# Altium schematic sheet ALU (4).SchDoc: Комбинационный сумматор
size 420 x 297 mm; CheckedBy: Хисамов; Author: Радионова; SheetNumber: 1; SheetTotal: 2; DocumentType: Схема электрическая принципиальная; DocumentName: Sheet1.SCHDOC
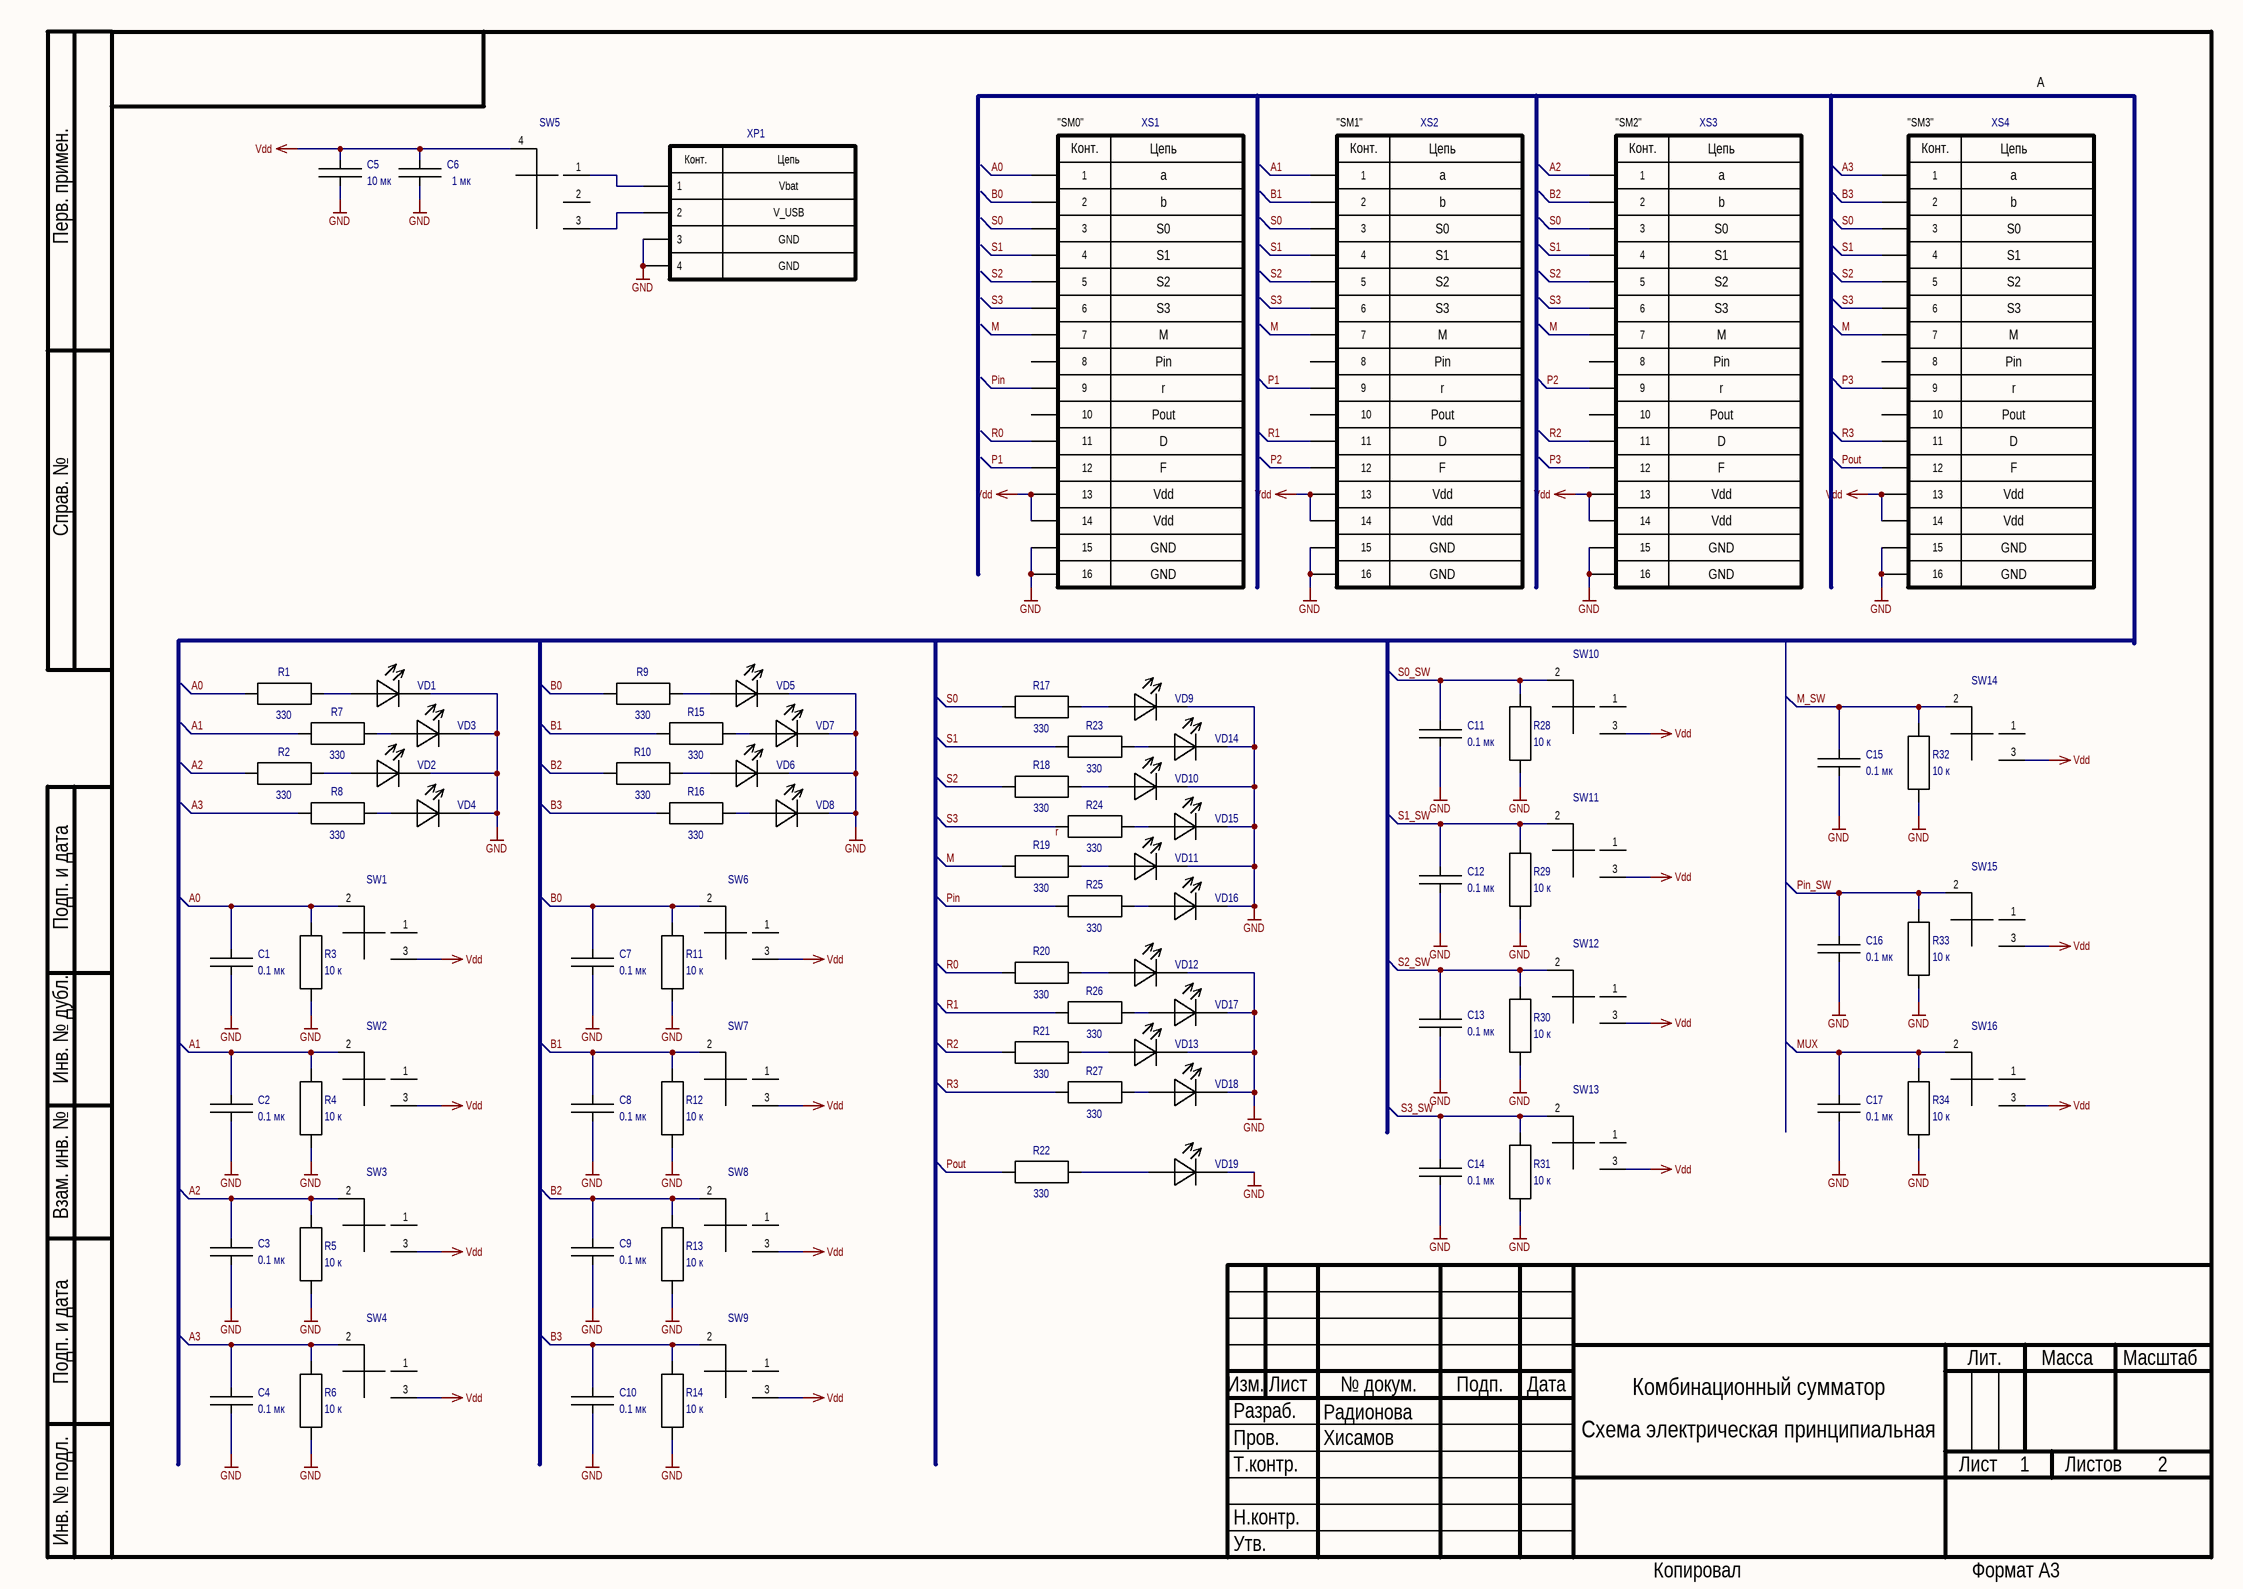
[diagram p0: ALU (4).SchDoc]

## Parts
C1  value 0.1 мк  [C0603]  (hidden comment: 0.1 мкФ ±* * * *, *)
C2  value 0.1 мк  [C0603]  (hidden comment: 0.1 мкФ ±* * * *, *)
C3  value 0.1 мк  [C0603]  (hidden comment: 0.1 мкФ ±* * * *, *)
C4  value 0.1 мк  [C0603]  (hidden comment: 0.1 мкФ ±* * * *, *)
C5  value 10 мк  [C0603]  (hidden comment: 10 мкФ ±* * * *, *)
C6  value 1 мк  [C0603]  (hidden comment: 1 мкФ ±* * * *, *)
C7  value 0.1 мк  [C0603]  (hidden comment: 0.1 мкФ ±* * * *, *)
C8  value 0.1 мк  [C0603]  (hidden comment: 0.1 мкФ ±* * * *, *)
C9  value 0.1 мк  [C0603]  (hidden comment: 0.1 мкФ ±* * * *, *)
C10  value 0.1 мк  [C0603]  (hidden comment: 0.1 мкФ ±* * * *, *)
C11  value 0.1 мк  [C0603]  (hidden comment: 0.1 мкФ ±* * * *, *)
C12  value 0.1 мк  [C0603]  (hidden comment: 0.1 мкФ ±* * * *, *)
C13  value 0.1 мк  [C0603]  (hidden comment: 0.1 мкФ ±* * * *, *)
C14  value 0.1 мк  [C0603]  (hidden comment: 0.1 мкФ ±* * * *, *)
C15  value 0.1 мк  [C0603]  (hidden comment: 0.1 мкФ ±* * * *, *)
C16  value 0.1 мк  [C0603]  (hidden comment: 0.1 мкФ ±* * * *, *)
C17  value 0.1 мк  [C0603]  (hidden comment: 0.1 мкФ ±* * * *, *)
R1  value 330  [P1-12-0.1(0603)]
R2  value 330  [P1-12-0.1(0603)]
R3  value 10 к  [P1-12-0.1(0603)]
R4  value 10 к  [P1-12-0.1(0603)]
R5  value 10 к  [P1-12-0.1(0603)]
R6  value 10 к  [P1-12-0.1(0603)]
R7  value 330  [P1-12-0.1(0603)]
R8  value 330  [P1-12-0.1(0603)]
R9  value 330  [P1-12-0.1(0603)]
R10  value 330  [P1-12-0.1(0603)]
R11  value 10 к  [P1-12-0.1(0603)]
R12  value 10 к  [P1-12-0.1(0603)]
R13  value 10 к  [P1-12-0.1(0603)]
R14  value 10 к  [P1-12-0.1(0603)]
R15  value 330  [P1-12-0.1(0603)]
R16  value 330  [P1-12-0.1(0603)]
R17  value 330  [P1-12-0.1(0603)]
R18  value 330  [P1-12-0.1(0603)]
R19  value 330  [P1-12-0.1(0603)]
R20  value 330  [P1-12-0.1(0603)]
R21  value 330  [P1-12-0.1(0603)]
R22  value 330  [P1-12-0.1(0603)]
R23  value 330  [P1-12-0.1(0603)]
R24  value 330  [P1-12-0.1(0603)]
R25  value 330  [P1-12-0.1(0603)]
R26  value 330  [P1-12-0.1(0603)]
R27  value 330  [P1-12-0.1(0603)]
R28  value 10 к  [P1-12-0.1(0603)]
R29  value 10 к  [P1-12-0.1(0603)]
R30  value 10 к  [P1-12-0.1(0603)]
R31  value 10 к  [P1-12-0.1(0603)]
R32  value 10 к  [P1-12-0.1(0603)]
R33  value 10 к  [P1-12-0.1(0603)]
R34  value 10 к  [P1-12-0.1(0603)]
SW1  SW_two  [MSS-22D18 MSS22D18G2]  (value not drawn)
SW2  SW_two  [MSS-22D18 MSS22D18G2]  (value not drawn)
SW3  SW_two  [MSS-22D18 MSS22D18G2]  (value not drawn)
SW4  SW_two  [MSS-22D18 MSS22D18G2]  (value not drawn)
SW5  *  [sw-3]  (value not drawn)
SW6  SW_two  [MSS-22D18 MSS22D18G2]  (value not drawn)
SW7  SW_two  [MSS-22D18 MSS22D18G2]  (value not drawn)
SW8  SW_two  [MSS-22D18 MSS22D18G2]  (value not drawn)
SW9  SW_two  [MSS-22D18 MSS22D18G2]  (value not drawn)
SW10  SW_two  [MSS-22D18 MSS22D18G2]  (value not drawn)
SW11  SW_two  [MSS-22D18 MSS22D18G2]  (value not drawn)
SW12  SW_two  [MSS-22D18 MSS22D18G2]  (value not drawn)
SW13  SW_two  [MSS-22D18 MSS22D18G2]  (value not drawn)
SW14  SW_two  [MSS-22D18 MSS22D18G2]  (value not drawn)
SW15  SW_two  [MSS-22D18 MSS22D18G2]  (value not drawn)
SW16  SW_two  [MSS-22D18 MSS22D18G2]  (value not drawn)
VD1  VD - Светодиод  [LED 0603]  (value not drawn)
VD2  VD - Светодиод  [LED 0603]  (value not drawn)
VD3  VD - Светодиод  [LED 0603]  (value not drawn)
VD4  VD - Светодиод  [LED 0603]  (value not drawn)
VD5  VD - Светодиод  [LED 0603]  (value not drawn)
VD6  VD - Светодиод  [LED 0603]  (value not drawn)
VD7  VD - Светодиод  [LED 0603]  (value not drawn)
VD8  VD - Светодиод  [LED 0603]  (value not drawn)
VD9  VD - Светодиод  [LED 0603]  (value not drawn)
VD10  VD - Светодиод  [LED 0603]  (value not drawn)
VD11  VD - Светодиод  [LED 0603]  (value not drawn)
VD12  VD - Светодиод  [LED 0603]  (value not drawn)
VD13  VD - Светодиод  [LED 0603]  (value not drawn)
VD14  VD - Светодиод  [LED 0603]  (value not drawn)
VD15  VD - Светодиод  [LED 0603]  (value not drawn)
VD16  VD - Светодиод  [LED 0603]  (value not drawn)
VD17  VD - Светодиод  [LED 0603]  (value not drawn)
VD18  VD - Светодиод  [LED 0603]  (value not drawn)
VD19  VD - Светодиод  [LED 0603]  (value not drawn)
XP1  1: Vbat  2: V_USB  3: GND  (hidden comment: XP - Вилка - х4)
XS1  XS - Розетка - PBD-16  [PLD-16Norm]  (value not drawn)  (net tie, no BOM)
XS2  XS - Розетка - PBD-16  [PLD-16Norm]  (value not drawn)  (net tie, no BOM)
XS3  XS - Розетка - PBD-16  [PLD-16Norm]  (value not drawn)  (net tie, no BOM)
XS4  XS - Розетка - PBD-16  [PLD-16Norm]  (value not drawn)  (net tie, no BOM)

## Nets
GND: C1.1 C2.1 C3.1 C4.1 C5.1 C6.1 C7.1 C8.1 C9.1 C10.1 C11.1 C12.1 C13.1 C14.1 C15.1 C16.1 C17.1 R3.2 R4.2 R5.2 R6.2 R11.2 R12.2 R13.2 R14.2 R28.2 R29.2 R30.2 R31.2 R32.2 R33.2 R34.2 VD1.2(C) VD2.2(C) VD3.2(C) VD4.2(C) VD5.2(C) VD6.2(C) VD7.2(C) VD8.2(C) VD9.2(C) VD10.2(C) VD11.2(C) VD12.2(C) VD13.2(C) VD14.2(C) VD15.2(C) VD16.2(C) VD17.2(C) VD18.2(C) VD19.2(C) XP1.3 XP1.4 XS1.15 XS1.16 XS2.15 XS2.16 XS3.15 XS3.16 XS4.15 XS4.16
Vdd: C5.2 C6.2 SW1.3 SW2.3 SW3.3 SW4.3 SW5.4 SW6.3 SW7.3 SW8.3 SW9.3 SW10.3 SW11.3 SW12.3 SW13.3 SW14.3 SW15.3 SW16.3 XS1.13 XS1.14 XS2.13 XS2.14 XS3.13 XS3.14 XS4.13 XS4.14
A0: C1.2 R1.1 R3.1 SW1.2 XS1.1
A1: C2.2 R4.1 R7.1 SW2.2 XS2.1
A2: C3.2 R2.1 R5.1 SW3.2 XS3.1
A3: C4.2 R6.1 R8.1 SW4.2 XS4.1
B0: C7.2 R9.1 R11.1 SW6.2 XS1.2
B1: C8.2 R12.1 R15.1 SW7.2 XS2.2
B2: C9.2 R10.1 R13.1 SW8.2 XS3.2
B3: C10.2 R14.1 R16.1 SW9.2 XS4.2
M: R19.1 XS1.7 XS2.7 XS3.7 XS4.7
M_SW: C15.2 R32.1 SW14.2
MUX: C17.2 R34.1 SW16.2
P1: XS1.12 XS2.9
P2: XS2.12 XS3.9
P3: XS3.12 XS4.9
Pin: R25.1 XS1.9
Pin_SW: C16.2 R33.1 SW15.2
Pout: R22.1 XS4.12
R0: R20.1 XS1.11
R1: R26.1 XS2.11
R2: R21.1 XS3.11
R3: R27.1 XS4.11
S0: R17.1 XS1.3 XS2.3 XS3.3 XS4.3
S0_SW: C11.2 R28.1 SW10.2
S1: R23.1 XS1.4 XS2.4 XS3.4 XS4.4
S1_SW: C12.2 R29.1 SW11.2
S2: R18.1 XS1.5 XS2.5 XS3.5 XS4.5
S2_SW: C13.2 R30.1 SW12.2
S3: R24.1 XS1.6 XS2.6 XS3.6 XS4.6
S3_SW: C14.2 R31.1 SW13.2
NetR1_2: R1.2 VD1.1(A)
NetR2_2: R2.2 VD2.1(A)
NetR7_2: R7.2 VD3.1(A)
NetR8_2: R8.2 VD4.1(A)
NetR9_2: R9.2 VD5.1(A)
NetR10_2: R10.2 VD6.1(A)
NetR15_2: R15.2 VD7.1(A)
NetR16_2: R16.2 VD8.1(A)
NetR17_2: R17.2 VD9.1(A)
NetR18_2: R18.2 VD10.1(A)
NetR19_2: R19.2 VD11.1(A)
NetR20_2: R20.2 VD12.1(A)
NetR21_2: R21.2 VD13.1(A)
NetR22_2: R22.2 VD19.1(A)
NetR23_2: R23.2 VD14.1(A)
NetR24_2: R24.2 VD15.1(A)
NetR25_2: R25.2 VD16.1(A)
NetR26_2: R26.2 VD17.1(A)
NetR27_2: R27.2 VD18.1(A)
NetSW5_1: SW5.1 XP1.1
NetSW5_3: SW5.3 XP1.2

Not connected (* = marked no-connect by the designer): SW1 1; SW2 1; SW3 1; SW4 1; SW5 2; SW6 1; SW7 1; SW8 1; SW9 1; SW10 1; SW11 1; SW12 1; SW13 1; SW14 1; SW15 1; SW16 1; XS1 8 10; XS2 8 10; XS3 8 10; XS4 8 10

## Notes on the sheet
- (near XS1) "SM0"
- (near XS2) "SM1"
- (near XS3) "SM2"
- (near XS4) "SM3"
- A
- Labels drawn without touching a wire or pin: r
- Перв. примен.
- Справ. №
- Подп. и дата
- Инв. № дубл.
- Взам. инв. №
- Разраб.
- Изм.
- Лист
- № докум.
- Подп.
- Дата
- Лит.
- Масса
- Масштаб
- Пров.
- Т.контр.
- Листов
- Инв. № подл.
- Утв.
- Н.контр.
- Копировал
- Формат А3
- (in symbol XP - Вилка - х4) Конт.; Цепь
- (in symbol XS -PBD-16) Конт.; Цепь; a; b; S0; S1; S2; S3; M; Pin; r; Pout; D; F; Vdd; GND

## Library data of the parts
C1-C17 = C: Company: *; PartNumber: *; Tolerance: *; Voltage: *; Type: *; Package: *
R1 R2 R7-R10 R15-R27 = R - Резистор: Company: *; PartNumber: *; Package: *; Tolerance: *
R3-R6 R11-R14 R28-R34 = R_1: Company: *; PartNumber: *; Package: *; Tolerance: *
SW5 = SW_three: pin to pad: 2>3 3>4 4>2
XS1-XS4 = XS -PBD-16
XP1 = XP - Вилка - х4: 4: GND